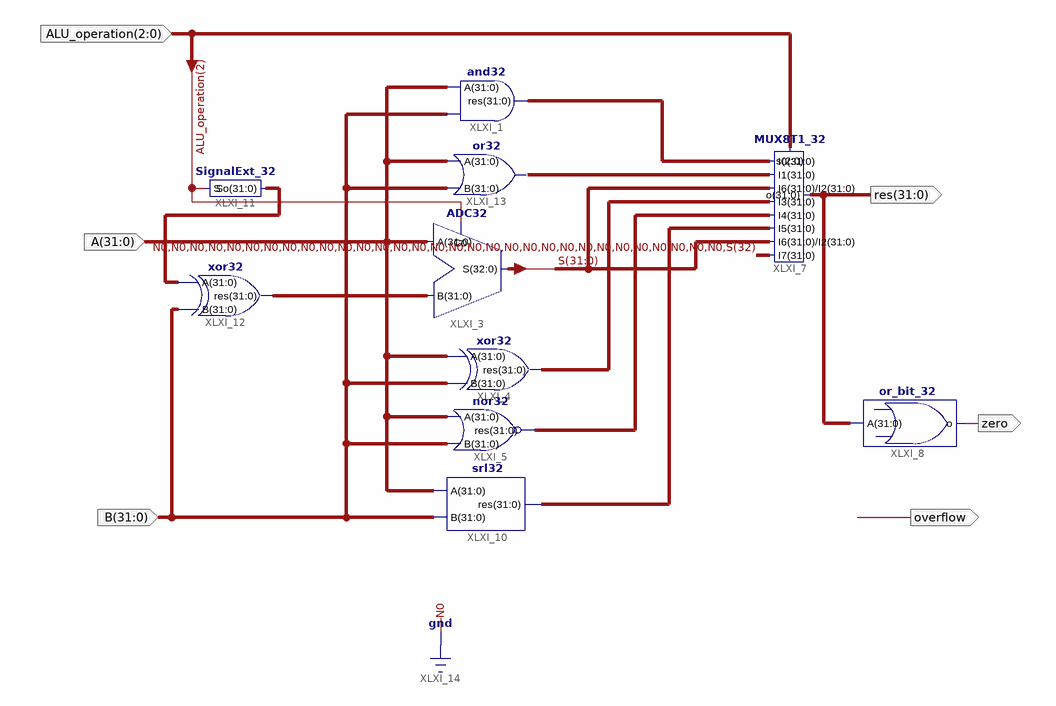
[diagram p0: schematic sheet 1]
// Xilinx ISE schematic alu.sch (kintex7) as structural Verilog: 10 symbols, 6 ports
module alu (
  input  [2:0] ALU_operation,
  input  [31:0] A,
  input  [31:0] B,
  output [31:0] res,
  output zero,
  output overflow
);

  wire [31:0] XLXN_16, XLXN_21, XLXN_22, XLXN_23, XLXN_33, XLXN_35, XLXN_36;
  wire [32:0] S;

  and32 XLXI_1 (.res(XLXN_16), .A(A), .B(B));
  ADC32 XLXI_3 (.B(XLXN_35), .A(A), .C0(ALU_operation[2]), .S(S));
  xor32 XLXI_4 (.A(A), .B(B), .res(XLXN_21));
  nor32 XLXI_5 (.res(XLXN_22), .A(A), .B(B));
  MUX8T1_32 XLXI_7 (
    .s(ALU_operation), .I7({{31{1'b0}}, S[32]}), .I6(S[31:0]), .I5(XLXN_23), .I4(XLXN_22), .I3(XLXN_21),
    .I2(S[31:0]), .I1(XLXN_36), .I0(XLXN_16), .o(res));
  or_bit_32 XLXI_8 (.o(zero), .A(res));
  srl32 XLXI_10 (.A(A), .B(B), .res(XLXN_23));
  SignalExt_32 XLXI_11 (.So(XLXN_33), .S(ALU_operation[2]));
  xor32 XLXI_12 (.A(XLXN_33), .B(B), .res(XLXN_35));
  or32 XLXI_13 (.res(XLXN_36), .A(A), .B(B));
endmodule
